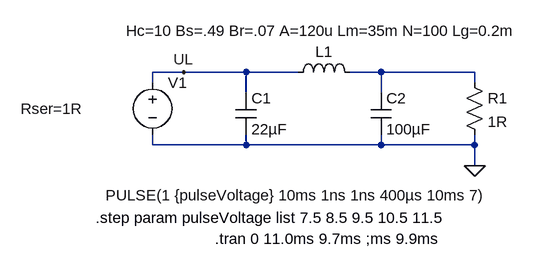
[diagram p0: schematic Filter_Saturation_Chanmodel.asc]
Filter_Saturation_Chanmodel.asc, the LTspice schematic file:
Version 4
SHEET 1 1000 680
WIRE 96 144 48 144
WIRE 192 144 96 144
WIRE 272 144 192 144
WIRE 400 144 352 144
WIRE 544 144 400 144
WIRE 48 160 48 144
WIRE 544 160 544 144
WIRE 192 176 192 144
WIRE 400 176 400 144
WIRE 48 256 48 240
WIRE 192 256 192 240
WIRE 192 256 48 256
WIRE 400 256 400 240
WIRE 400 256 192 256
WIRE 544 256 544 240
WIRE 544 256 400 256
WIRE 544 288 544 256
FLAG 544 288 0
FLAG 96 144 UL
SYMBOL ind 256 160 R270
WINDOW 3 95 54 VBottom 2
WINDOW 0 32 56 VTop 2
SYMATTR Value Hc=10 Bs=.49 Br=.07 A=120u Lm=35m N=100 Lg=0.2m
SYMATTR InstName L1
SYMATTR SpiceLine Ipk=50 Rser=0.2
SYMBOL voltage 48 144 R0
WINDOW 3 -72 189 Left 2
WINDOW 123 0 0 Left 0
WINDOW 39 -203 56 Left 2
SYMATTR Value PULSE(1 {pulseVoltage} 10ms 1ns 1ns 400µs 10ms 7)
SYMATTR SpiceLine Rser=1R
SYMATTR InstName V1
SYMBOL cap 176 176 R0
SYMATTR InstName C1
SYMATTR Value 22µF
SYMBOL res 528 144 R0
SYMATTR InstName R1
SYMATTR Value 1R
SYMBOL cap 384 176 R0
SYMATTR InstName C2
SYMATTR Value 100µF
TEXT 144 400 Left 2 !.tran 0 11.0ms 9.7ms ;ms 9.9ms
TEXT -40 368 Left 2 !.step param pulseVoltage list 7.5 8.5 9.5 10.5 11.5

The netlist it stands for:
* Filter_Saturation_Chanmodel.asc
L1 UL N001 Hc=10 Bs=.49 Br=.07 A=120u Lm=35m N=100 Lg=0.2m Ipk=50 Rser=0.2
V1 UL 0 PULSE(1 {pulseVoltage} 10ms 1ns 1ns 400µs 10ms 7) Rser=1R
C1 UL 0 22µF
R1 N001 0 1R
C2 N001 0 100µF
.tran 0 11.0ms 9.7ms ;ms 9.9ms
.step param pulseVoltage list 7.5 8.5 9.5 10.5 11.5
.backanno
.end